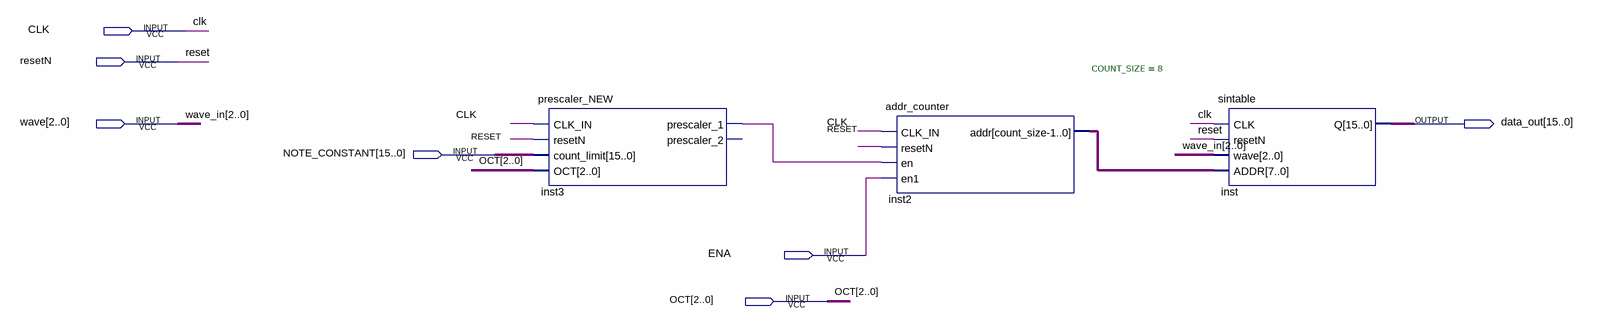
[diagram p0: schematic sheet]
// Quartus schematic note_model.bdf as structural Verilog: 3 symbols, 7 pins
module note_model (
  input  CLK,
  input  resetN,
  input  [2:0] wave,
  input  [15:0] NOTE_CONSTANT,
  input  ENA,
  input  [2:0] OCT,
  output [15:0] data_out
);

  wire inst3_prescaler_1;
  wire [7:0] inst2_addr;

  prescaler_NEW inst3 (
    .CLK_IN(CLK), .resetN(resetN), .count_limit(NOTE_CONSTANT), .OCT(OCT), .prescaler_1(inst3_prescaler_1));  // open: prescaler_2
  addr_counter #(.COUNT_SIZE(8)) inst2 (
    .CLK_IN(CLK), .resetN(resetN), .en(inst3_prescaler_1), .en1(ENA), .addr(inst2_addr));
  sintable inst (.CLK(CLK), .resetN(resetN), .wave(wave), .ADDR(inst2_addr), .Q(data_out));

  // Other names for the same wires on the sheet: reset = resetN; wave_in[2:0] = wave
endmodule
